# Altium project SimpleLDOConverter.PrjPcb
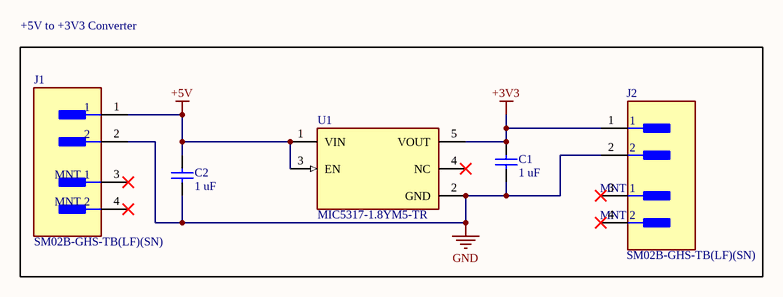
[diagram p0: Sheet1.SchDoc]
1 sheet, 5 parts. Net scope: global (net labels, ports and power ports of the same name join across sheets).
Board file: LDO_PCB.PcbDoc

## Sheet Sheet1.SchDoc
size A; SheetNumber: 1; SheetTotal: 1

### Parts
C1  1 uF  [CAPC2013X145X50ML20T25]
C2  1 uF  [CAPC2013X145X50ML20T25]
J1  SM02B-GHS-TB(LF)(SN)  [FP-SM02B-GHS-TB_LF_SN-MFG]
J2  SM02B-GHS-TB(LF)(SN)  [FP-SM02B-GHS-TB_LF_SN-MFG]
U1  MIC5317-1.8YM5-TR  [FP-SOT23-5LD-PL-1-MFG]

### Blocks framed on the sheet
+5V to +3V3 Converter: C1 C2 J1 J2 U1

### Nets
+3V3: C1.2 J2.1 U1.5(VOUT)
+5V: C2.2 J1.1 U1.1(VIN) U1.3(EN)
GND: C1.1 C2.1 J1.2 J2.2 U1.2(GND)

Not connected (* = marked no-connect by the designer): J1 3(MNT_1)* 4(MNT_2)*; J2 3(MNT_1)* 4(MNT_2)*; U1 4(NC)*

### Library data of the parts
C1 C2 = CMP-2007-01253-1: Part Number: C0805C105K8NACTU; Manufacturer: Kemet
J1 J2 = CMP-2000-07076-2: CONN HEADER SMD R/A 2POS 1.25MM; Voltage Rating: 50V; Number of Positions: 2; Pitch: 0.049inch; Current Rating: 1A; Connector Type: Outer Shroud Contact; Number of Rows: 1; Contact Material: Bronze; Termination: Solder; Color: Natural; Package Quantity: 2500; Mount: Surface Mount; Housing Color: Natural; Number of Contacts: 2; Packaging: Tape and Reel; Lead Free: Lead Free; Housing Material: Nylon; Orientation: Right Angle; Contact Type: Male Pin; Contact Plating: Tin; Series: GH; Fastening Type: Latch
U1 = CMP-00252-66802792-1: MIC5317-1.8YM5-TR LDO Regulator Pos 1.8V 0.15A 5-Pin SOT-23 T/R; Number of Outputs: 1; Dropout Voltage: 155mV; Power Supply Rejection Ratio (PSRR): 70dB; Max Input Voltage: 6V; Min Input Voltage: 2.5V; Output Current: 150mA; Min Current Limit: 200mA; Schedule B: 8542390000, 8542390000; Min Operating Temperature: -40°C; Lifecycle Status: Production; NexarPartId: 66802792; Mount: Surface Mount; Output Voltage: 1.8V; Number of Regulators: 1; RoHS: Compliant; Case/Package: SOT-23-5; Max Operating Temperature: 125°C